# Altium schematic sheet Power.SchDoc
size B
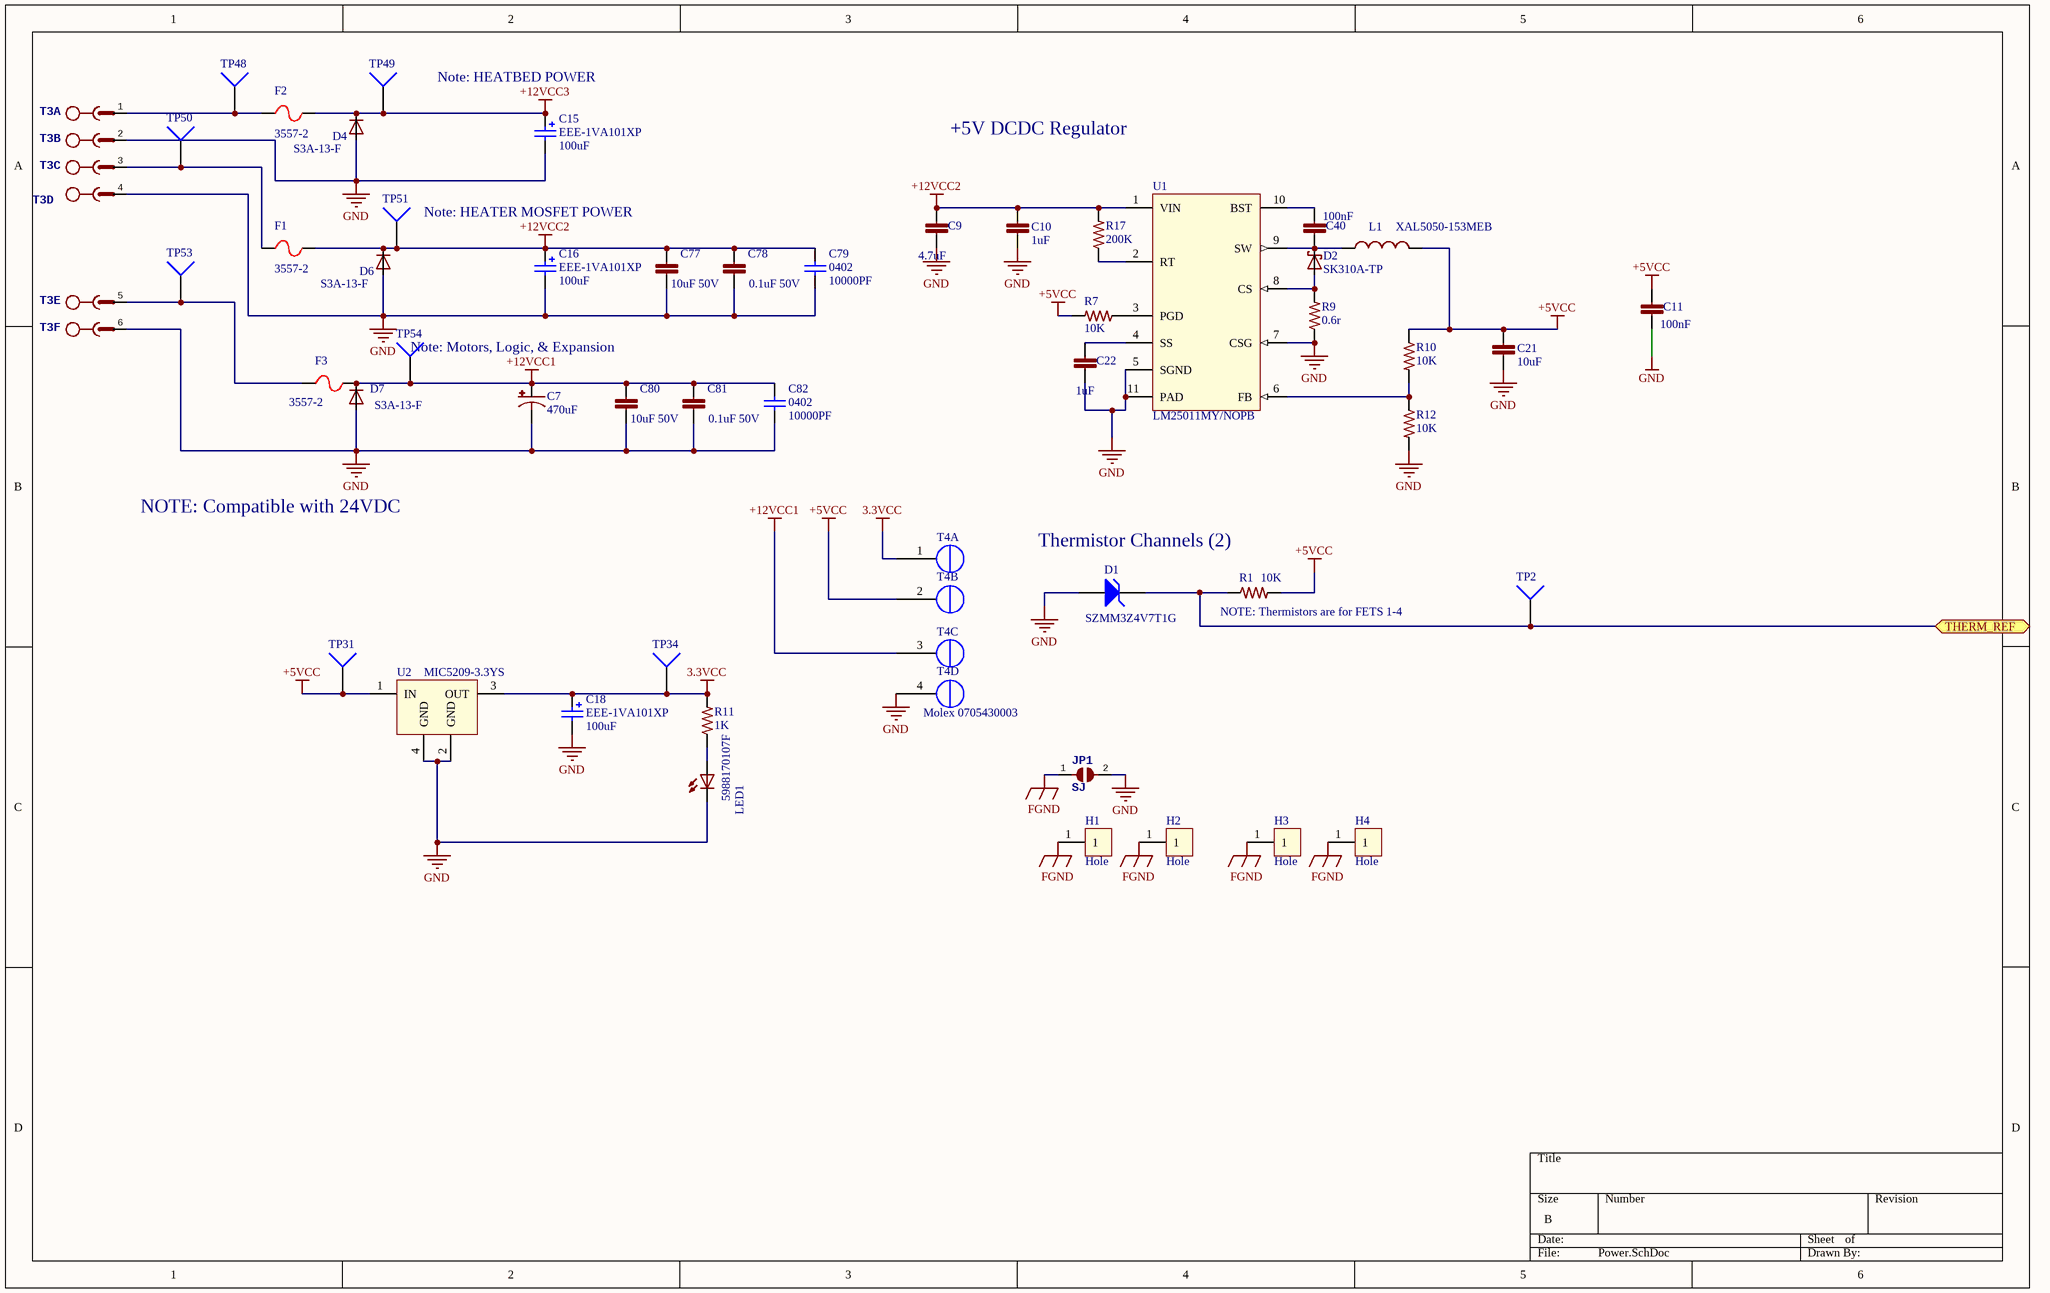
[diagram p0: Power.SchDoc]

## Parts
C7  470uF  [C12,5-5]
C9  4.7uF  [C1206]
C10  1uF  [C0805]
C11  100nF  [C0603]
C15  EEE-1VA101XP  value 100uF  [EEE-1VA101XP]
C16  EEE-1VA101XP  value 100uF  [EEE-1VA101XP]
C18  EEE-1VA101XP  value 100uF  [EEE-1VA101XP]
C21  10uF  [C0805]
C22  1uF  [C0402]
C40  100nF  [C0603]
C77  10uF 50V  [C1206]
C78  0.1uF 50V  [C0603]
C79  value 10000PF  [C0402]  (hidden comment: 0402)
C80  10uF 50V  [C1206]
C81  0.1uF 50V  [C0603]
C82  value 10000PF  [C0402]  (hidden comment: 0402)
D1  SZMM3Z4V7T1G  [SZMM3Z4V7T1G]
D2  SK310A-TP  [SMA-SM]
D4  S3A-13-F  [DO-214AB]
D6  S3A-13-F  [DO-214AB]
D7  S3A-13-F  [DO-214AB]
F1  3557-2  [3557]
F2  3557-2  [3557]
F3  3557-2  [3557]
H1  Hole  [Wave_hole_3x7-singleSided]  (no BOM)
H2  Hole  [Wave_hole_3x7-singleSided]  (no BOM)
H3  Hole  [Wave_hole_3x7-singleSided]  (no BOM)
H4  Hole  [Wave_hole_3x7-singleSided]  (no BOM)
JP1  SJ  [SJ]
L1  XAL5050-153MEB  [XAL50xx-153]
LED1  5988170107F  [LED2012120]
R1  10K  [R0603]
R7  10K  [R0603]
R9  0.6r  [2512R-0.55]
R10  10K  [R0603]
R11  1K  [R0603]
R12  10K  [R0603]
R17  200K  [R0402]
T3  MSTBV6  [MSTBV6]  (value not drawn)  (parts A,B,C,D,E,F of 6)
T4  Molex 0705430003  [4POL254]  (parts A,B,C,D of 4)
TP2  TP4  [TP-2]  (value not drawn)
TP31  TP4  [TP-2]  (value not drawn)
TP34  TP4  [TP-2]  (value not drawn)
TP48  TP4  [TP-2]  (value not drawn)
TP49  TP4  [TP-2]  (value not drawn)
TP50  TP4  [TP-2]  (value not drawn)
TP51  TP4  [TP-2]  (value not drawn)
TP53  TP4  [TP-2]  (value not drawn)
TP54  TP4  [TP-2]  (value not drawn)
U1  LM25011MY/NOPB  [VSSOP10]
U2  MIC5209-3.3YS  [SOT230P700X190-4N]

## Ports
THERM_REF

## Nets
3.3VCC: C18.1 R11.2 T4.1(OUT2B) TP34.1 U2.3(OUT)
+5VCC: C11.1 C21.1 L1.2 R1.2 R7.2 R10.1 T4.2(OUT2A) TP31.1 U2.1(IN)
+12VCC1: C7.1(+) C80.1 C81.1 C82.2 D7.C F3.2 T4.3(OUT1A) TP54.1
+12VCC2: C9.1 C10.1 C16.1 C77.1 C78.1 C79.2 D6.C F1.2 R17.2 TP51.1 U1.1(VIN)
+12VCC3: C15.1 D4.C F2.2 TP49.1
FGND: H1.1 H2.1 H3.1 H4.1 JP1.1
GND: C7.2(-) C9.2 C10.2 C11.2 C15.2 C16.2 C18.2 C21.2 C22.2 C77.2 C78.2 C79.1 C80.2 C81.2 C82.1 D1.1(A) D4.A D6.A D7.A JP1.2 LED1.C R9.1 R12.2 T3.2 T3.4 T3.6 T4.4(OUT1B) U1.5(SGND) U1.7(CSG) U1.11(PAD) U2.2(GND) U2.4(GND)
THERM_REF: D1.2(K) R1.1 TP2.1 ; port THERM_REF
NetC22_1: C22.1 U1.4(SS)
NetC40_1: C40.1 U1.10(BST)
NetC40_2: C40.2 D2.C L1.1 U1.9(SW)
NetD2_A: D2.A R9.2 U1.8(CS)
NetF1_1: F1.1 T3.3 TP50.1
NetF2_1: F2.1 T3.1 TP48.1
NetF3_1: F3.1 T3.5 TP53.1
NetLED1_A: LED1.A R11.1
NetR7_1: R7.1 U1.3(PGD)
NetR10_2: R10.2 R12.1 U1.6(FB)
NetR17_1: R17.1 U1.2(RT)

## Notes on the sheet
- Note: HEATBED POWER
- +5V DCDC Regulator
- Note: HEATER MOSFET POWER
- (near TP54) Note: Motors, Logic, & Expansion
- NOTE: Compatible with 24VDC
- Thermistor Channels (2)
- (near R1) NOTE: Thermistors are for FETS 1-4

## Library data of the parts
C7 = UPW1H471MHD1TO: CAP ALU 470uF 50V 20%; LastRevisionNote: ImportComponents; Published: 23-Apr-2014; Publisher: UltiMachine; LastRevisionDate: 23-Apr-2014; ManufacturerPartNumber: UPW1H471MHD1TO; VALUE: 470uF
C9 = C1206C475K5PACTU: CAP CER 1206 4.7uF 50V 10% X5R; LastRevisionNote: ImportComponents; Published: 23-Apr-2014; Publisher: UltiMachine; LastRevisionDate: 23-Apr-2014; ManufacturerPartNumber: C1206C475K5PACTU; VALUE: 4.7uF
C10 = GRM21BR71H105KA12L: CAP CER 0805 1uF 50V 10% X7R; LastRevisionNote: ImportComponents; Published: 23-Apr-2014; Publisher: UltiMachine; LastRevisionDate: 23-Apr-2014; ManufacturerPartNumber: GRM21BR71H105KA12L; VALUE: 1uF
C11 C40 = C0603C104K5RACTU: CAP CER 0603 100nF 50V 10% X7R; LastRevisionNote: ImportComponents; LastRevisionDate: 23-Apr-2014; ManufacturerPartNumber: C0603C104K5RACTU; Published: 23-Apr-2014; Publisher: UltiMachine; VALUE: 100nF
C15 C16 C18 = EEE-1VA101XP: CAP ALUM 100UF 35V 20% SMD; Manufacture: Panasonic; Digikey Part #: PCE3951CT-ND; Price: $0.63; Mount Type: SMT Panasonic VS D Series; Status: Active; Height: 7.70mm; Datasheet: http://industrial.panasonic.com/www-cgi/jvcr13pz.cgi?E+PZ+3+ABA0002+EEE1VA101XP+7+WW; Manufacture Part #: EEE-1VA101XP
C21 = C0805C106K8PACTU: CAP CER 0805 10uF 10V 10% X5R; LastRevisionNote: ImportComponents; Published: 23-Apr-2014; Publisher: UltiMachine; LastRevisionDate: 23-Apr-2014; ManufacturerPartNumber: C0805C106K8PACTU; VALUE: 10uF
C22 = GRM155R60J105KE19D: CAP CER 0402 1uF 6.3V 10% X5R; LastRevisionNote: ImportComponents; Published: 23-Apr-2014; Publisher: UltiMachine; LastRevisionDate: 23-Apr-2014; ManufacturerPartNumber: GRM155R60J105KE19D; VALUE: 1uF
C77 C80 = CL31A106KBHNNNE: CAP CER 10UF 50V 10% X5R 1206; Manufacturer: Samsung; LastRevisionNote: ImportComponents; Published: 25-mar-2015; Publisher: UltiMachine; LastRevisionDate: 25-mar-2015; ManufacturerPartNumber: CL31A106KBHNNNE; VALUE: 10uF 50V
C78 C81 = CL10B104KB8SFNC: CAP CER 0.1UF 50V 10% X7R 0603; LastRevisionNote: ImportComponents; Published: 23-Apr-2014; Publisher: UltiMachine; LastRevisionDate: 23-Apr-2014; ManufacturerPartNumber: CL10B104KB8SFNC; VALUE: 0.1uF 50V
C79 C82 = CL05B103JB5NNNC: CAP CER 10000PF 50V 5% X7R 0402; Manufacturer: Samsung; Voltage: 16v; Published: 10 - Dec - 2014; LatestRevisionDate: 10 - Dec - 2014; LatestRevisionNote: Ultimachine Footprint Added; Publisher: Ultimachine; Component Type: Chip Capacitor; Manufacture Part #: CL05B103JB5NNNC; Part Description: CAP CER 10000PF 50V 5% X7R 0402; Mounting Type: SMT 0402; Datasheet: https://www.samsungsem.com/kr/front/downloadcms.do?path=/kr/support/product-search/mlcc/__icsFiles/afieldfile/2014/11/05&fileName=S_CL05B103JB5NNNC.pdf; Height: 0.25 ± 0.15mm; Tolerance: 5%; PackageReference: 0402
D1 = D Zener: Zener Diode; Published: 8-Jun-2000; LatestRevisionDate: 17-Jul-2002; LatestRevisionNote: Re-released for DXP Platform.; PackageReference: DIODE-0.7; Publisher: Altium Limited; PackageDescription: Diode, Thru-Hole; 2 Leads; 0.7 in Pin Spacing
D2 = SK310A: DIODE Schottky 3A SMA; LastRevisionNote: ImportComponents; LastRevisionDate: 23-Apr-2014; ManufacturerPartNumber: SK310A; Published: 23-Apr-2014; Publisher: UltiMachine
D4 D6 D7 = S3A-13-F: DIODE DO-214AB; LastRevisionNote: ImportComponents; Published: 23-Apr-2014; Publisher: UltiMachine; LastRevisionDate: 23-Apr-2014; Value: S3A-13-F
F1-F3 = 3557-2: FUSE PTH ATO; LastRevisionNote: ImportComponents; Published: 23-Apr-2014; Publisher: UltiMachine; LastRevisionDate: 23-Apr-2014; ManufacturerPartNumber: 3557-2
JP1 = SJ: SMD solder jumper; LastRevisionNote: ImportComponents; Published: 23-Apr-2014; Publisher: UltiMachine; LastRevisionDate: 23-Apr-2014
L1 = XAL5050-153MEB: IND 15uH 3.9A 20%; LastRevisionNote: ImportComponents; Published: 23-Apr-2014; Publisher: UltiMachine; LastRevisionDate: 23-Apr-2014; ManufacturerPartNumber: XAL5050-153MEB; Value: XAL5050-153MEB
LED1 = 5988170107F: LED 0805 Green; LastRevisionNote: ImportComponents; Published: 23-Apr-2014; Publisher: UltiMachine; LastRevisionDate: 23-Apr-2014; VALUE: 5988170107F
R1 R7 R10 R12 = ERJ-3EKF1002V: RES 0603 10K 100mW 1%; LastRevisionNote: ImportComponents; Published: 23-Apr-2014; Publisher: UltiMachine; LastRevisionDate: 23-Apr-2014; ManufacturerPartNumber: ERJ-3EKF1002V; VALUE: 10K
R9 = RL2512FK-070R06L: RES 0.06 OHM 1W 1% 2512 SMD; LastRevisionNote: ImportComponents; Published: 23-Apr-2014; Publisher: UltiMachine; LastRevisionDate: 23-Apr-2014; ManufacturerPartNumber: RL2512FK-070R06L; VALUE: 0.6r
R11 = ERJ-3EKF1001V: RES 0603 1K 100mW 1%; LastRevisionNote: ImportComponents; Published: 23-Apr-2014; Publisher: UltiMachine; LastRevisionDate: 23-Apr-2014; ManufacturerPartNumber: ERJ-3EKF1001V; VALUE: 1K
R17 = CRCW0402200KFKED: RES 0402 22r 63mW 1%; LastRevisionNote: ImportComponents; Published: 23-Apr-2014; Publisher: UltiMachine; LastRevisionDate: 23-Apr-2014; ManufacturerPartNumber: CRCW0402200KFKED; VALUE: 200K
T3 = MSTBV6: PHOENIX; LastRevisionNote: ImportComponents; Published: 23-Apr-2014; Publisher: UltiMachine; LastRevisionDate: 23-Apr-2014
T4 = Molex 0705430003 Alt: Molex 4 Pin Clip Connector
TP2 TP31 TP34 TP48-TP51 TP53 TP54 = Socket: LatestRevisionDate: 17-Jul-2002; LatestRevisionNote: Re-released for DXP Platform.; Publisher: Altium Limited
U1 = LM25011: REG BUCK; Value: LM25011MY/NOPB